# EAGLE design display (EAGLE 7.3.0)
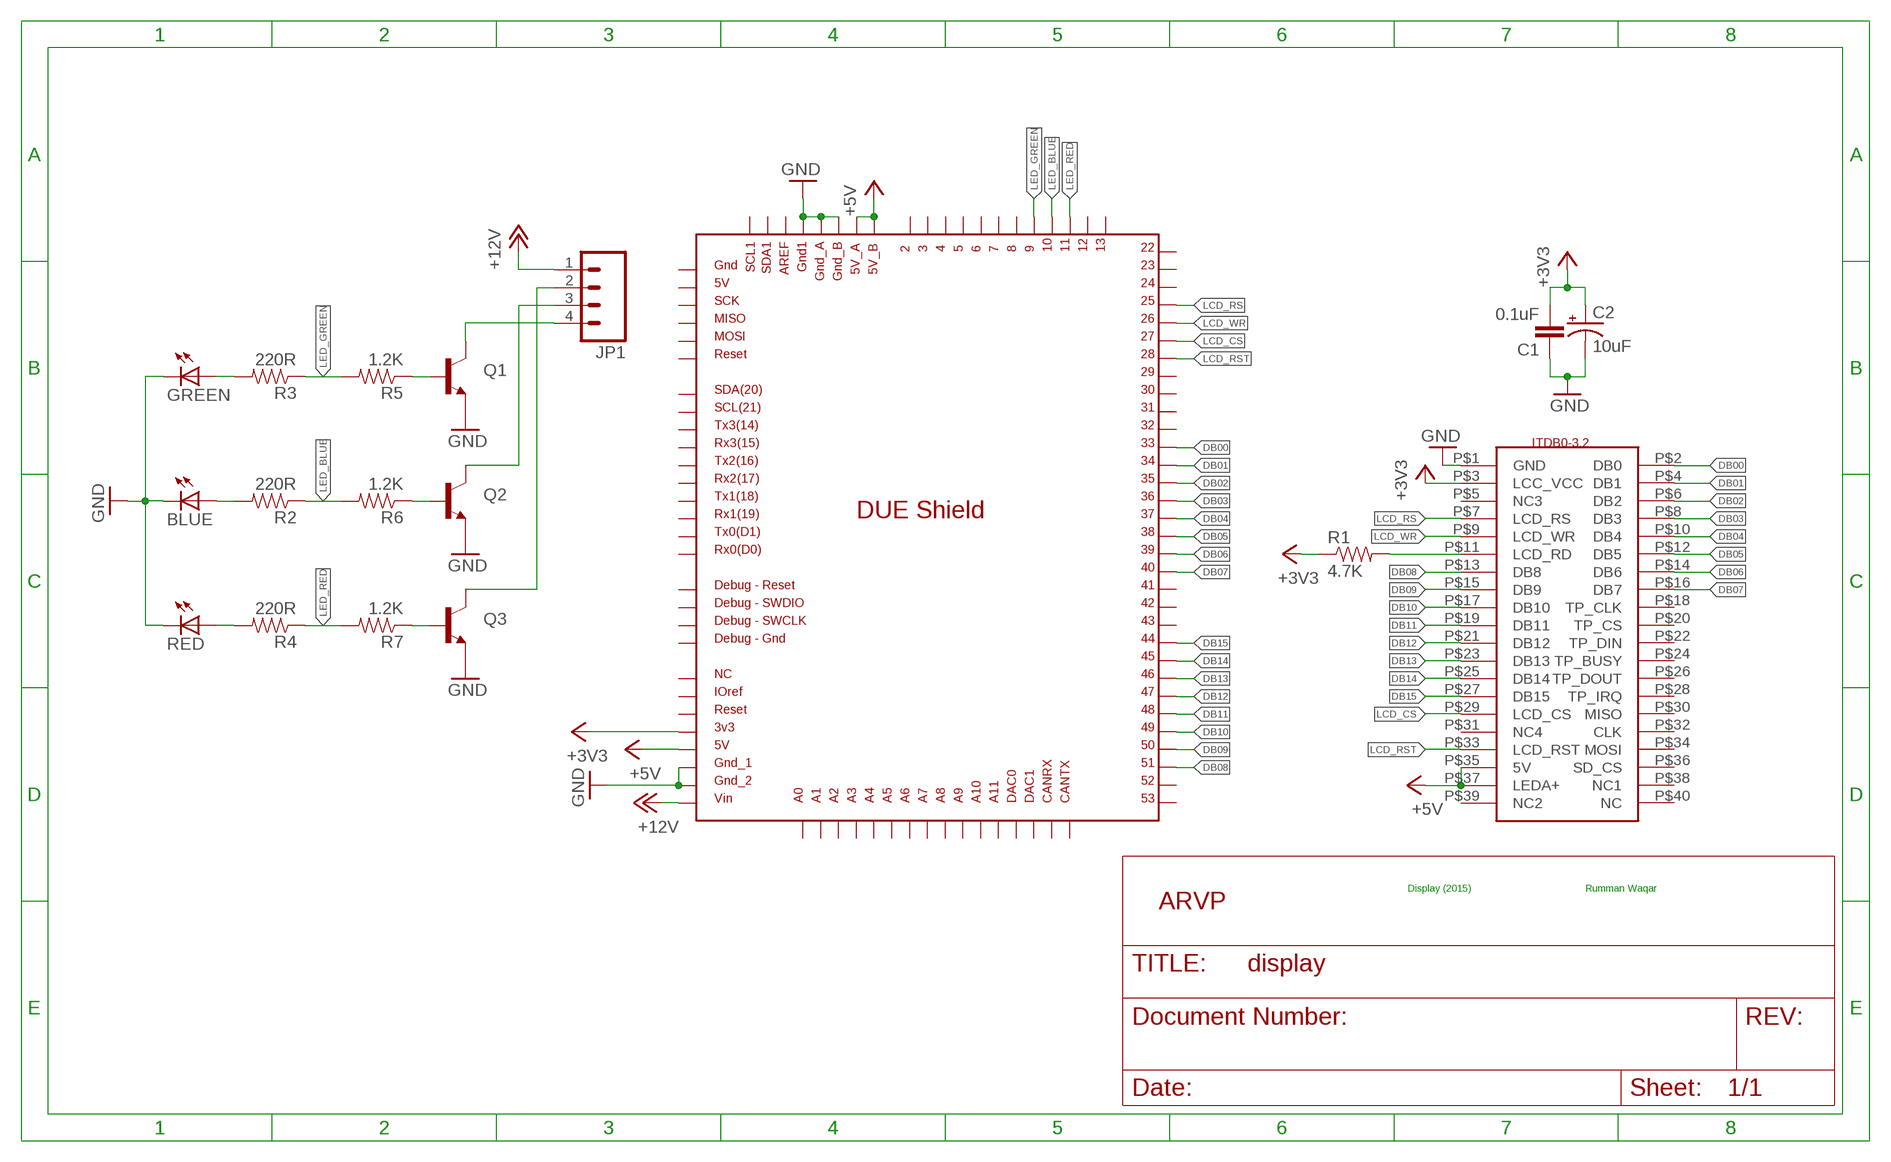
[diagram p0: schematic, sheet 1]

## Parts
BLUE  LED1206  [LED-1206]
C1  0.1uF  CAP1206  [1206]
C2  10uF  CAP_POL1206  [EIA3216]
GREEN  LED1206  [LED-1206]
JP1  M04POLAR  [MOLEX-1X4]
Q1  TRANSISTOR_NPN"  [SOT223]
Q2  TRANSISTOR_NPN"  [SOT223]
Q3  TRANSISTOR_NPN"  [SOT223]
R1  4.7K  RESISTOR0805-RES  [0805]
R2  220R  RESISTOR1206  [1206]
R3  220R  RESISTOR1206  [1206]
R4  220R  RESISTOR1206  [1206]
R5  1.2K  RESISTOR1206  [1206]
R6  1.2K  RESISTOR1206  [1206]
R7  1.2K  RESISTOR1206  [1206]
RED  LED1206  [LED-1206]
U$1  DUE(NORMAL)  [DUE(NORMAL)]
U$2  ARVP_LOGO  [ARVP]
U$3  ITDB0-3.2  [ITDB02-3.2]

## Nets
+3V3: C1.2 C2.A(+) R1.1 U$1.3V3 U$3.P$3(LCC_VCC)
+5V: U$1.5V U$1.5V_A U$1.5V_B U$3.P$35(5V) U$3.P$37(LEDA+)
+12V: JP1.1 U$1.VIN
DB00: U$1.33 U$3.P$2(DB0)
DB01: U$1.34 U$3.P$4(DB1)
DB02: U$1.35 U$3.P$6(DB2)
DB03: U$1.36 U$3.P$8(DB3)
DB04: U$1.37 U$3.P$10(DB4)
DB05: U$1.38 U$3.P$12(DB5)
DB06: U$1.39 U$3.P$14(DB6)
DB07: U$1.40 U$3.P$16(DB7)
DB08: U$1.51 U$3.P$13(DB8)
DB09: U$1.50 U$3.P$15(DB9)
DB10: U$1.49 U$3.P$17(DB10)
DB11: U$1.48 U$3.P$19(DB11)
DB12: U$1.47 U$3.P$21(DB12)
DB13: U$1.46 U$3.P$23(DB13)
DB14: U$1.45 U$3.P$25(DB14)
DB15: U$1.44 U$3.P$27(DB15)
GND: BLUE.C C1.1 C2.C(-) GREEN.C Q1.3(E) Q2.3(E) Q3.3(E) RED.C U$1.GND1 U$1.GND_1 U$1.GND_2 U$1.GND_A U$1.GND_B U$3.P$1(GND)
LCD_CS: U$1.27 U$3.P$29(LCD_CS)
LCD_RS: U$1.25 U$3.P$7(LCD_RS)
LCD_RST: U$1.28 U$3.P$33(LCD_RST)
LCD_WR: U$1.26 U$3.P$9(LCD_WR)
LED_BLUE: R2.1 R6.2 U$1.10
LED_GREEN: R3.1 R5.2 U$1.9
LED_RED: R4.1 R7.2 U$1.11
N$1: R1.2 U$3.P$11(LCD_RD)
N$2: JP1.4 Q1.2(C)
N$3: JP1.3 Q2.2(C)
N$4: Q3.1(B) R7.1
N$5: JP1.2 Q3.2(C)
N$6: Q2.1(B) R6.1
N$7: Q1.1(B) R5.1
N$11: GREEN.A R3.2
N$12: R4.2 RED.A
N$13: BLUE.A R2.2
Unconnected: U$1.2 U$1.3 U$1.4 U$1.5 U$1.5V_ICSP U$1.6 U$1.7 U$1.8 U$1.12 U$1.13 U$1.22 U$1.23 U$1.24 U$1.29 U$1.30 U$1.31 U$1.32 U$1.41 U$1.42 U$1.43 U$1.52 U$1.53 U$1.A0 U$1.A1 U$1.A2 U$1.A3 U$1.A4 U$1.A5 U$1.A6 U$1.A7 U$1.A8 U$1.A9 U$1.A10 U$1.A11 U$1.AREF U$1.CANRX U$1.CANTX U$1.DAC0 U$1.DAC1 U$1.GND_DEBUG U$1.GND_ICSP U$1.IOREF U$1.MISO_ICSP U$1.MOSI_ICSP U$1.NC U$1.RESET U$1.RESET_DEBUG U$1.RESET_ICSP U$1.RX0 U$1.RX1 U$1.RX2 U$1.RX3 U$1.SCK_ICSP U$1.SCL U$1.SCL1 U$1.SDA U$1.SDA1 U$1.SWCLK_DEBUG U$1.SWDIO_DEBUG U$1.TX0 U$1.TX1 U$1.TX2 U$1.TX3 U$3.P$5(NC3) U$3.P$18(TP_CLK) U$3.P$20(TP_CS) U$3.P$22(TP_DIN) U$3.P$24(TP_BUSY) U$3.P$26(TP_DOUT) U$3.P$28(TP_IRQ) U$3.P$30(MISO) U$3.P$31(NC4) U$3.P$32(CLK) U$3.P$34(MOSI) U$3.P$36(SD_CS) U$3.P$38(NC1) U$3.P$39(NC2) U$3.P$40(NC)

## Notes on the sheet
- Display (2015) | Rumman Waqar

## Library data of the parts
BLUE GREEN RED = SparkFun:LED: LEDs Standard schematic elements and footprints for 5mm, 3mm, 1206, and 0603 sized LEDs. 5mm - Spark Fun Electronics SKU : COM-00529 (and others)
C1 = SparkFun:CAP: Capacitor Standard 0603 ceramic capacitor, and 0.1" leaded capacitor.
C2 = SparkFun:CAP_POL: Capacitor Polarized These are standard SMD and PTH capacitors. Normally 10uF, 47uF, and 100uF in electrolytic and tantalum varieties. Always verify the external diameter of the through hole cap, it varies with capacity, voltage, and manufacturer. The EIA devices should be standard.
JP1 = SparkFun:M04: Header 4 Standard 4-pin 0.1" header. Use with straight break away headers (SKU : PRT-00116), right angle break away headers (PRT-00553), swiss pins (PRT-00743), machine pins (PRT-00117), and female headers (PRT-00115). Molex polarized connector foot print use with SKU : PRT-08231 with associated crimp pins and housings. 1MM SMD Version SKU: PRT-10208
Q1-Q3 = SparkFun:TRANSISTOR_NPN: Transistor NPN BJT configuration in SOT23 package. MMBT2222 is the common NPN we use. Double check BCE configuration again layout.
R1-R7 = SparkFun:RESISTOR: Resistor Basic schematic elements and footprints for 0603, 1206, and PTH resistors.
U$1 = DUElib130425:DUE(NORMAL)
U$2 = ARVP:ARVP_LOGO
U$3 = ARVP:ITDB0-3.2

## Board
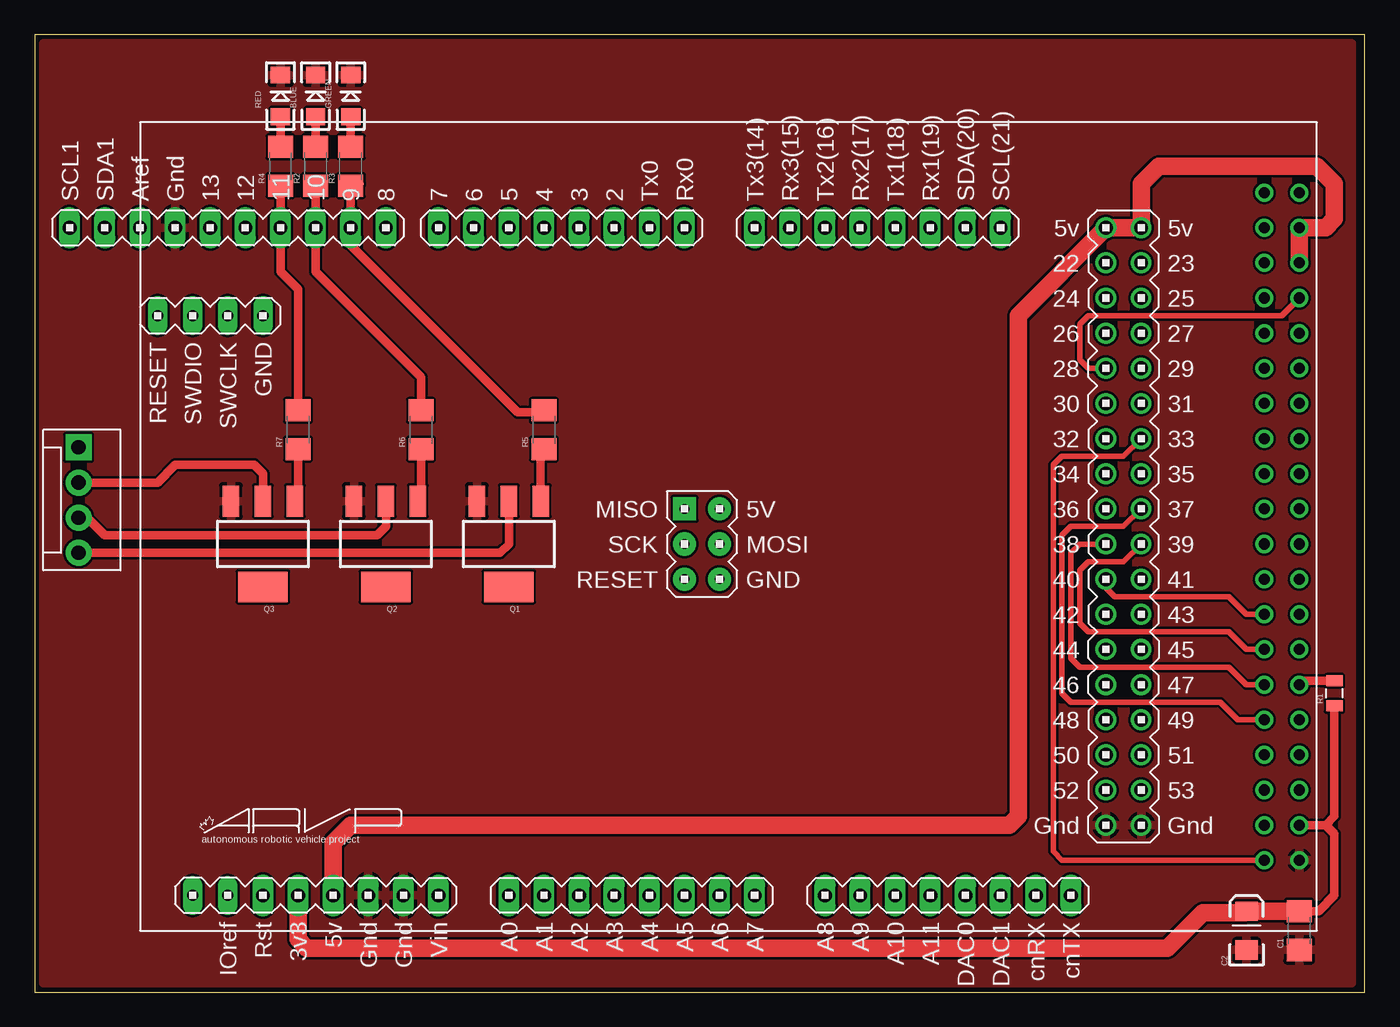
[diagram p1: board, top side]
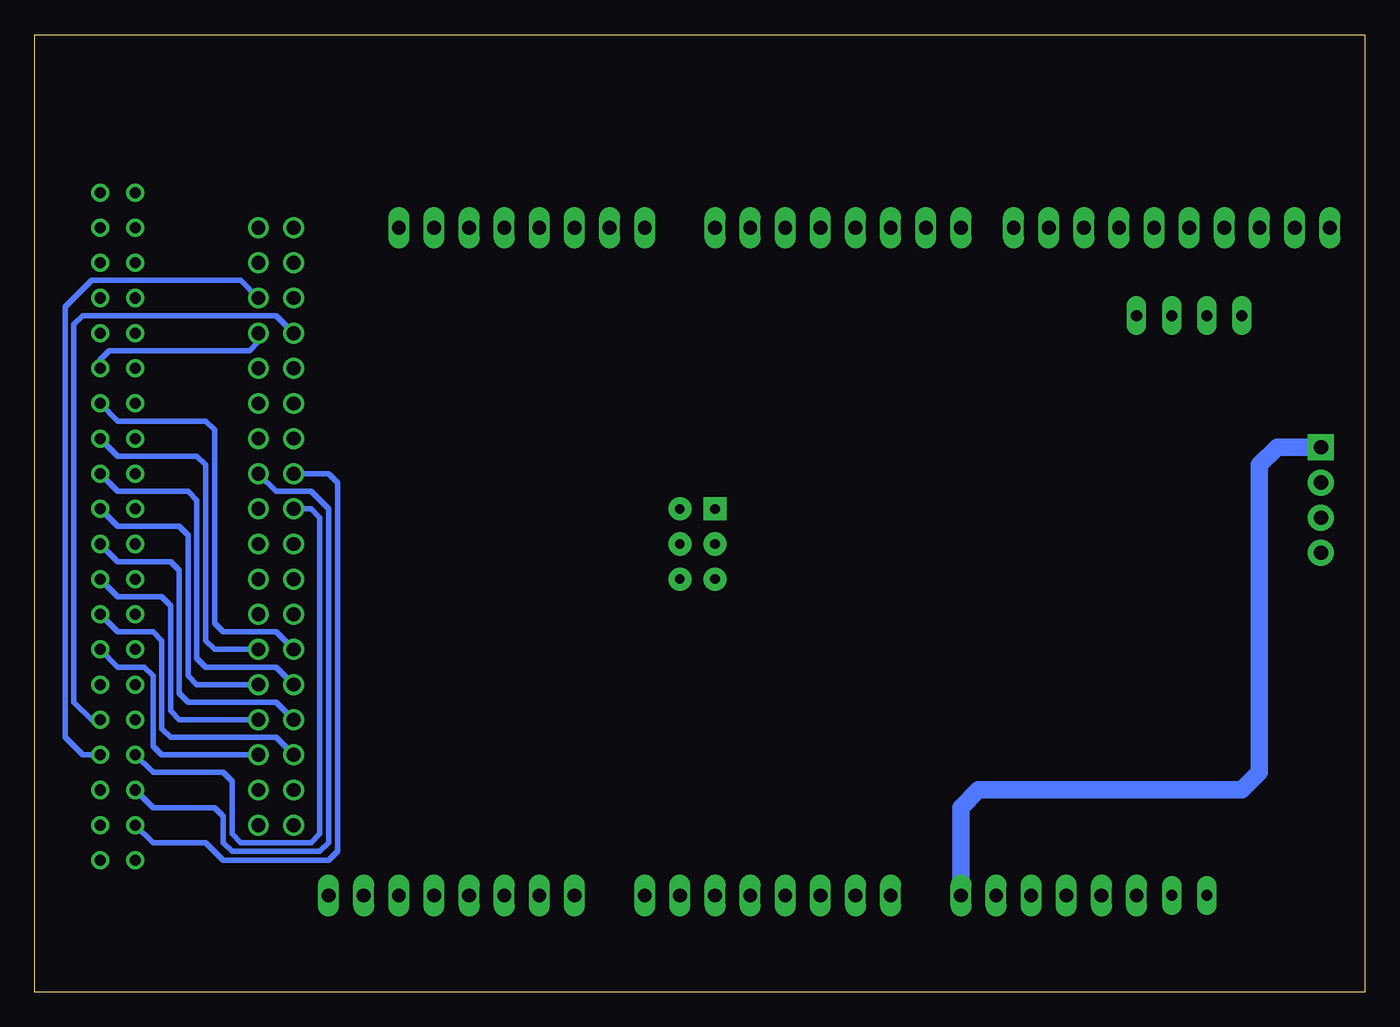
[diagram p2: board, bottom side, seen from below]

Size 96.19 x 69.2 mm. Coordinates in mm from the lower left corner, seen from the top.
Outline: 0,0 96.19,0 96.19,69.2 0,69.2 0,0
Copper layers (1*16): Top 0.035mm / dielectric 1.5mm / Bottom 0.035mm
Design rules "apcircuits": minimum track width 0.18mm, minimum drill 20mil, track to track 0.18mm, track to pad 0.18mm, pad to pad 0.18mm, via to via 0.18mm, smd to smd 0.18mm, copper to edge 0.25mm, drill to drill 0.25mm, minimum pad ring 10mil, minimum via ring 8mil, stop-mask expansion 4mil, vias tented up to drill 0mil, thermal gap 10mil

### Footprints (pad centres in the part's own frame; a part is rotated, then mirrored left to right if it is on the bottom)
LED-1206 = smd 1.2 x 1.4: A -1.5,0; C 1.5,0
1206 = smd 1.6 x 1.8: 1 -1.4,0; 2 1.4,0
EIA3216 = smd 1.4 x 1.6: A 1.4,0; C -1.4,0
MOLEX-1X4 = drill 1.016 pad 1.88 square: 1 0,0 | drill 1.016 pad 1.88: 2 2.54,0; 3 5.08,0; 4 7.62,0
SOT223 = smd 1.219 x 2.235: 1 -2.311,-3.099; 2 0,-3.099; 3 2.311,-3.099 | smd 3.6 x 2.2: 4 0,3.099
0805 = smd 0.8 x 1.2: 1 -0.9,0; 2 0.9,0
DUE(NORMAL) = drill 1 long: 2 -16.51,30.48; 3 -19.05,30.48; 3V3 -39.37,-17.78; 4 -21.59,30.48; 5 -24.13,30.48; 5V -36.83,-17.78; 6 -26.67,30.48; 7 -29.21,30.48; 8 -33.02,30.48; 9 -35.56,30.48; 10 -38.1,30.48; 11 -40.64,30.48; 12 -43.18,30.48; 13 -45.72,30.48; A0 -24.13,-17.78; A1 -21.59,-17.78; A2 -19.05,-17.78; A3 -16.51,-17.78; A4 -13.97,-17.78; A5 -11.43,-17.78; A6 -8.89,-17.78; A7 -6.35,-17.78; A8 -1.27,-17.78; A9 1.27,-17.78; A10 3.81,-17.78; A11 6.35,-17.78; AREF -50.8,30.48; CANRX 13.97,-17.78; CANTX 16.51,-17.78; DAC0 8.89,-17.78; DAC1 11.43,-17.78; GND1 -48.26,30.48; GND_1 -34.29,-17.78; GND_2 -31.75,-17.78; RESET -41.91,-17.78; RX0 -11.43,30.48; RX1 6.35,30.48; RX2 1.27,30.48; RX3 -3.81,30.48; SCL 11.43,30.48; SCL1 -55.88,30.48; SDA 8.89,30.48; SDA1 -53.34,30.48; TX0 -13.97,30.48; TX1 3.81,30.48; TX2 -1.27,30.48; TX3 -6.35,30.48; VIN -29.21,-17.78 | drill 1: 5V_A 19.05,30.48; 5V_B 21.59,30.48; 22 19.05,27.94; 23 21.59,27.94; 24 19.05,25.4; 25 21.59,25.4; 26 19.05,22.86; 27 21.59,22.86; 28 19.05,20.32; 29 21.59,20.32; 30 19.05,17.78; 31 21.59,17.78; 32 19.05,15.24; 33 21.59,15.24; 34 19.05,12.7; 35 21.59,12.7; 36 19.05,10.16; 37 21.59,10.16; 38 19.05,7.62; 39 21.59,7.62; 40 19.05,5.08; 41 21.59,5.08; 42 19.05,2.54; 43 21.59,2.54; 44 19.05,0; 45 21.59,0; 46 19.05,-2.54; 47 21.59,-2.54; 48 19.05,-5.08; 49 21.59,-5.08; 50 19.05,-7.62; 51 21.59,-7.62; 52 19.05,-10.16; 53 21.59,-10.16; GND_A 19.05,-12.7; GND_B 21.59,-12.7 | drill 0.7 pad 1.676: 5V_ICSP -8.89,5.08; GND_ICSP -8.89,10.16; MOSI_ICSP -8.89,7.62; RESET_ICSP -11.43,5.08; SCK_ICSP -11.43,7.62 | drill 0.8 pad 1.422 long: GND_DEBUG -41.91,24.13; IOREF -44.45,-17.78; NC -46.99,-17.78; RESET_DEBUG -49.53,24.13; SWCLK_DEBUG -44.45,24.13; SWDIO_DEBUG -46.99,24.13 | drill 0.7 pad 1.676 square: MISO_ICSP -11.43,10.16
ITDB02-3.2 = drill 0.8: P$1 -10.16,0; P$2 -10.16,2.54; P$3 -7.62,0; P$4 -7.62,2.54; P$5 -5.08,0; P$6 -5.08,2.54; P$7 -2.54,0; P$8 -2.54,2.54; P$9 0,0; P$10 0,2.54; P$11 2.54,0; P$12 2.54,2.54; P$13 5.08,0; P$14 5.08,2.54; P$15 7.62,0; P$16 7.62,2.54; P$17 10.16,0; P$18 10.16,2.54; P$19 12.7,0; P$20 12.7,2.54; P$21 15.24,0; P$22 15.24,2.54; P$23 17.78,0; P$24 17.78,2.54; P$25 20.32,0; P$26 20.32,2.54; P$27 22.86,0; P$28 22.86,2.54; P$29 25.4,0; P$30 25.4,2.54; P$31 27.94,0; P$32 27.94,2.54; P$33 30.48,0; P$34 30.48,2.54; P$35 33.02,0; P$36 33.02,2.54; P$37 35.56,0; P$38 35.56,2.54; P$39 38.1,0; P$40 38.1,2.54

### Placement (x,y rotation side)
BLUE  20.32,64.77 90 top
C1  91.44,4.44 90 top
C2  87.63,4.44 90 top
GREEN  22.86,64.77 90 top
JP1  3.18,39.37 270 top
Q1  34.29,32.38 180 top
Q2  25.4,32.38 180 top
Q3  16.51,32.38 180 top
R1  93.98,21.59 90 top
R2  20.32,59.69 90 top
R3  22.86,59.69 90 top
R4  17.78,59.69 90 top
R5  36.83,40.64 90 top
R6  27.94,40.64 90 top
R7  19.05,40.64 90 top
RED  17.78,64.77 90 top
U$1  58.42,24.77 0 top
U$2  12.06,10.79 0 top
U$3  91.44,19.69 90 top

### Tracks (layer width: path | path; a pad name or v marks a point on that pad's centre or on a via)
+3V3
  Top 0.61: U$3.P$3 93.34,12.06 | 93.34,12.06 93.98,12.7 R1.1 | C1.2 92.84,5.84 93.98,6.98 93.98,11.43 93.34,12.06
  Top 1.27: C1.2 C2.A 87.5,5.71 84.45,5.71 81.91,3.17 19.69,3.17 19.05,3.81 U$1.3V3
+5V
  Top 1.27: U$3.P$35 U$3.P$37 93.34,55.24 93.98,55.88 93.98,58.42 92.71,59.69 81.28,59.69 80.01,58.42 U$1.5V_B U$1.5V_A 71.12,48.89 71.12,12.7 70.48,12.06 22.86,12.06 21.59,10.79 U$1.5V
+12V
  Bottom 1.27: JP1.1 6.35,39.37 7.62,38.1 7.62,15.87 8.89,14.6 27.94,14.6 29.21,13.33 U$1.VIN
DB00
  Top 0.406: U$3.P$2 74.3,9.53 73.66,10.16 73.66,38.1 74.3,38.73 78.74,38.73 U$1.33
DB01
  Bottom 0.406: U$3.P$4 87.63,10.79 83.82,10.79 82.55,9.53 74.93,9.53 74.3,10.16 74.3,36.83 74.93,37.46 U$1.34
DB02
  Bottom 0.406: U$3.P$6 87.63,13.33 83.19,13.33 82.55,12.7 82.55,10.79 81.91,10.16 75.56,10.16 74.93,10.79 74.93,34.92 76.2,36.2 78.74,36.2 U$1.35
DB03
  Bottom 0.406: U$3.P$8 87.63,15.87 82.55,15.87 81.91,15.24 81.91,11.43 81.28,10.79 76.2,10.79 75.56,11.43 75.56,34.29 76.2,34.92 U$1.36
DB04
  Top 0.406: U$3.P$10 87,19.69 85.72,20.95 74.93,20.95 74.3,21.59 74.3,33.02 74.93,33.65 78.74,33.65 U$1.37
DB05
  Top 0.406: U$3.P$12 87.63,22.23 86.36,23.49 75.56,23.49 74.93,24.13 74.93,31.75 75.56,32.38 U$1.38
DB06
  Top 0.406: U$3.P$14 87.63,24.77 86.36,26.03 76.2,26.03 75.56,26.67 75.56,30.48 76.2,31.11 78.74,31.11 U$1.39
DB07
  Top 0.406: U$3.P$16 87.63,27.3 86.36,28.57 78.11,28.57 77.47,29.21 U$1.40
DB08
  Bottom 0.406: U$3.P$13 90.17,23.49 88.27,23.49 87.63,22.86 87.63,17.78 87,17.14 U$1.51
DB09
  Bottom 0.406: U$1.50 78.74,18.41 86.36,18.41 87,19.05 87,25.4 87.63,26.03 90.17,26.03 U$3.P$15
DB10
  Bottom 0.406: U$3.P$17 90.17,28.57 87,28.57 86.36,27.94 86.36,20.32 85.72,19.69 U$1.49
DB11
  Bottom 0.406: U$1.48 78.74,20.95 85.09,20.95 85.72,21.59 85.72,30.48 86.36,31.11 90.17,31.11 U$3.P$19
DB12
  Bottom 0.406: U$3.P$21 90.17,33.65 85.72,33.65 85.09,33.02 85.09,22.86 84.45,22.23 U$1.47
DB13
  Bottom 0.406: U$1.46 78.74,23.49 83.82,23.49 84.45,24.13 84.45,35.56 85.09,36.2 90.17,36.2 U$3.P$23
DB14
  Bottom 0.406: U$1.45 83.19,24.77 83.82,25.4 83.82,38.1 84.45,38.73 90.17,38.73 U$3.P$25
DB15
  Bottom 0.406: U$1.44 78.74,26.03 82.55,26.03 83.19,26.67 83.19,40.64 83.82,41.27 90.17,41.27 U$3.P$27
GND
  pour Top: 0.64,68.58 95.25,68.58 95.25,0.63 0.64,0.63
LCD_CS
  Bottom 0.406: U$3.P$29 91.44,45.72 90.8,46.35 80.64,46.35 80.01,46.99 U$1.27
LCD_RS
  Bottom 0.406: U$3.P$7 92.71,17.14 93.98,18.41 93.98,49.53 92.08,51.43 81.28,51.43 U$1.25
LCD_RST
  Top 0.406: U$1.28 76.2,45.09 75.56,45.72 75.56,48.26 76.2,48.89 90.17,48.89 U$3.P$33
LCD_WR
  Bottom 0.406: U$3.P$9 92.08,19.69 93.34,20.95 93.34,48.26 92.71,48.89 78.74,48.89 U$1.26
LED_BLUE
  Top 0.61: R2.1 U$1.10 20.32,52.07 27.94,44.45 R6.2
LED_GREEN
  Top 0.61: R3.1 22.99,58.42 23.5,58.42 22.86,57.79 U$1.9 22.86,53.97 34.92,41.91 36.7,41.91 R5.2
LED_RED
  Top 0.61: R4.1 U$1.11 17.78,52.07 19.05,50.8 R7.2
N$1
  Top 0.61: R1.2 91.7,22.49 U$3.P$11
N$2
  Top 0.61: JP1.4 33.66,31.75 34.29,32.38 Q1.2
N$3
  Top 0.61: JP1.3 3.81,34.29 5.08,33.02 24.77,33.02 25.4,33.65 Q2.2
N$4
  Top 0.61: R7.1 19.05,35.71 Q3.1
N$5
  Top 0.61: JP1.2 8.89,36.83 10.16,38.1 15.87,38.1 16.51,37.46 Q3.2
N$6
  Top 0.61: R6.1 27.94,35.71 Q2.1
N$7
  Top 0.61: Q1.1 36.6,39.01 R5.1
N$11
  Top 0.61: R3.2 GREEN.A
N$12
  Top 0.61: R4.2 RED.A
N$13
  Top 0.61: R2.2 BLUE.A